# EAGLE design PanelPCB (EAGLE 9.6.2)
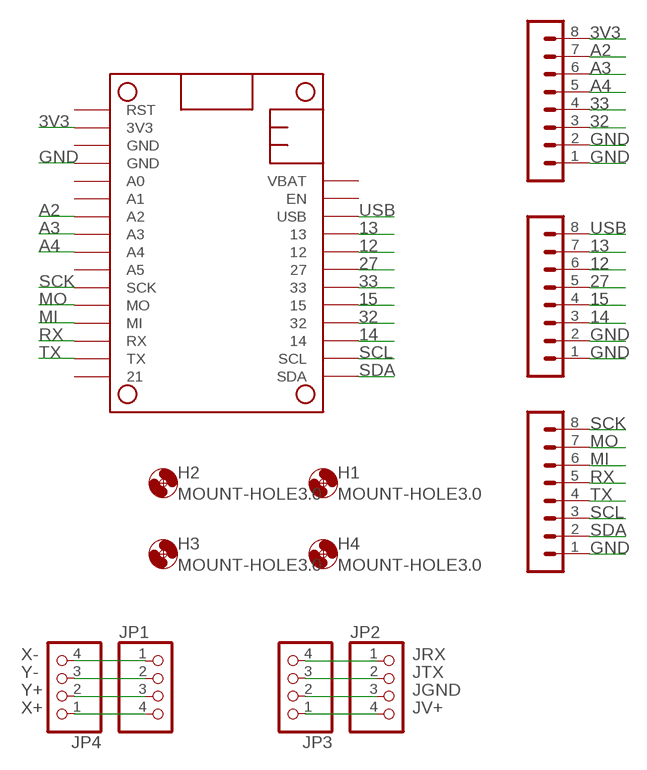
[diagram p0: schematic, sheet 1]

## Parts
H1  MOUNT-HOLE3.0  [3,0]
H2  MOUNT-HOLE3.0  [3,0]
H3  MOUNT-HOLE3.0  [3,0]
H4  MOUNT-HOLE3.0  [3,0]
JP1  PINHD-1X4  [1X04]
JP2  PINHD-1X4  [1X04]
JP3  PINHD-1X4  [1X04]
JP4  PINHD-1X4  [1X04]
M1  RARNDT-MISCELANEOUS_FEATHERBOARD_ESP32FETHERWING_DIM_ESP32  [RARNDT-MISCELANEOUS_FEATHERBOARD_ESP32]
SV1  MA08-1  [MA08-1]
SV2  MA08-1  [MA08-1]
SV3  MA08-1  [MA08-1]

## Nets
3V3: M1.2(3V3) SV1.8
12: M1.24 SV2.6
13: M1.25 SV2.7
14: M1.19 SV2.3
15: M1.21 SV2.4
27: M1.23 SV2.5
32: M1.20 SV1.3
33: M1.22 SV1.4
A2: M1.7(A2) SV1.7
A3: M1.8(A3) SV1.6
A4: M1.9(A4) SV1.5
GND: M1.4(GND) SV1.1 SV1.2 SV2.1 SV2.2 SV3.1
JGND: JP2.3 JP3.2
JRX: JP2.1 JP3.4
JTX: JP2.2 JP3.3
JV+: JP2.4 JP3.1
MI: M1.13(MI) SV3.6
MO: M1.12(MO) SV3.7
RX: M1.14(RX) SV3.5
SCK: M1.11(SCK) SV3.8
SCL: M1.18(SCL) SV3.3
SDA: M1.17(SDA) SV3.2
TX: M1.15(TX) SV3.4
USB: M1.26(USB) SV2.8
X+: JP1.4 JP4.1
X-: JP1.1 JP4.4
Y+: JP1.3 JP4.2
Y-: JP1.2 JP4.3
Unconnected: M1.1(RST) M1.3(GND) M1.5(A0) M1.6(A1) M1.10(A5) M1.16 M1.27(EN) M1.28(VBAT)

## Library data of the parts
H1-H4 = holes:MOUNT-HOLE: MOUNTING HOLE with drill center marker
JP1-JP4 = pinhead:PINHD-1X4: PIN HEADER
M1 = StewartPlatform:RARNDT-MISCELANEOUS_FEATHERBOARD_ESP32
SV1-SV3 = con-lstb:MA08-1: PIN HEADER; OC_FARNELL: unknown; OC_NEWARK: unknown

## Board
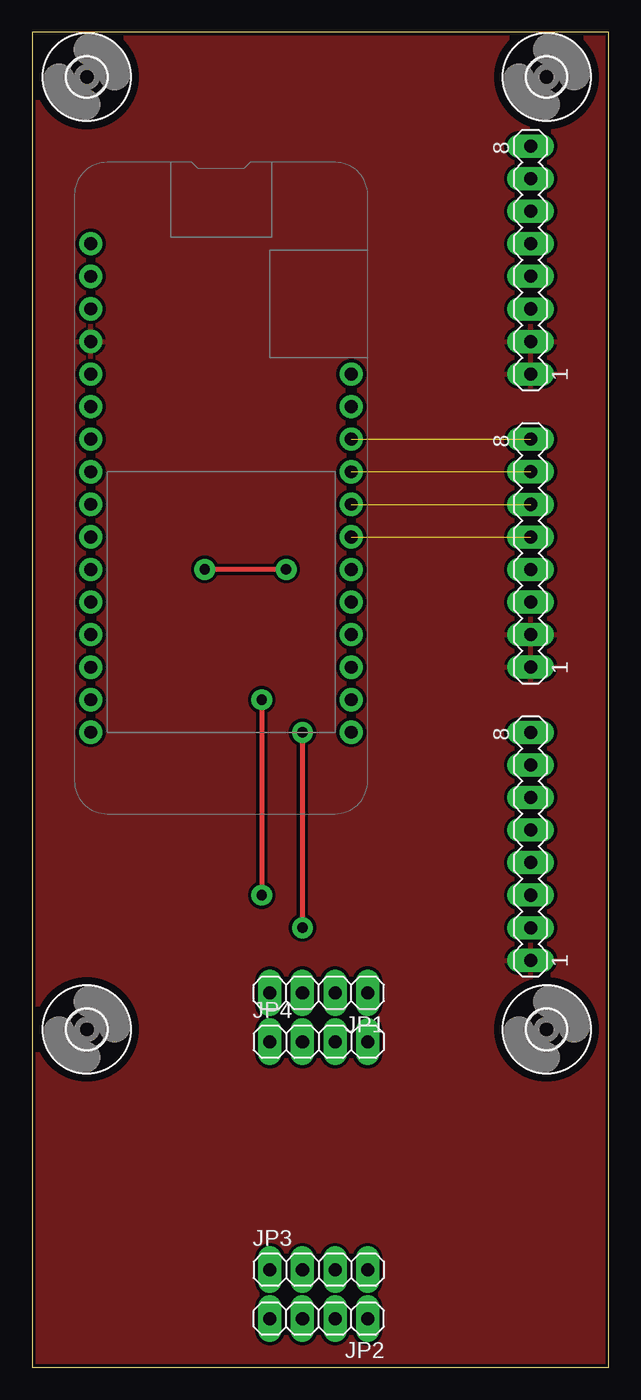
[diagram p1: board, top side]
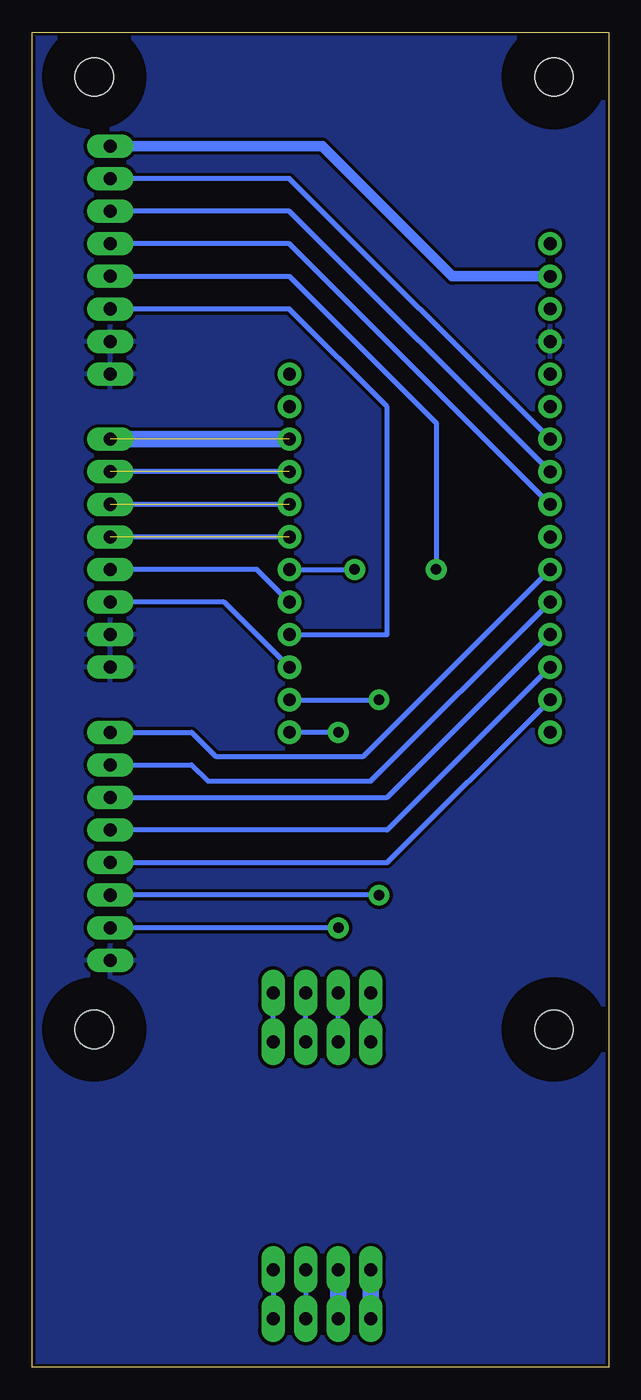
[diagram p2: board, bottom side, seen from below]

Size 44.96 x 104.14 mm. Coordinates in mm from the lower left corner, seen from the top.
Outline: 0,0 44.96,0 44.96,104.14 0,104.14 0,0
Copper layers (1*16): Top 0.035mm / dielectric 1.5mm / Bottom 0.035mm
Design rules "fablab_lpkf": minimum track width 16mil, minimum drill 32mil, track to track 10mil, track to pad 10mil, pad to pad 10mil, via to via 10mil, smd to smd 10mil, copper to edge 10mil, drill to drill 10mil, minimum pad ring 16mil, minimum via ring 16mil, stop-mask expansion 4mil, vias tented up to drill 0mil, thermal gap 10mil

### Footprints (pad centres in the part's own frame; a part is rotated, then mirrored left to right if it is on the bottom)
3,0 = hole 3: 0,0
1X04 = drill 1.016 long: 1 -3.81,0; 2 -1.27,0; 3 1.27,0; 4 3.81,0
RARNDT-MISCELANEOUS_FEATHERBOARD_ESP32 = drill 1: 1 -19.05,-10.16; 2 -16.51,-10.16; 3 -13.97,-10.16; 4 -11.43,-10.16; 5 -8.89,-10.16; 6 -6.35,-10.16; 7 -3.81,-10.16; 8 -1.27,-10.16; 9 1.27,-10.16; 10 3.81,-10.16; 11 6.35,-10.16; 12 8.89,-10.16; 13 11.43,-10.16; 14 13.97,-10.16; 15 16.51,-10.16; 16 19.05,-10.16; 17 19.05,10.16; 18 16.51,10.16; 19 13.97,10.16; 20 11.43,10.16; 21 8.89,10.16; 22 6.35,10.16; 23 3.81,10.16; 24 1.27,10.16; 25 -1.27,10.16; 26 -3.81,10.16; 27 -6.35,10.16; 28 -8.89,10.16
MA08-1 = drill 1.016 long: 1 -8.89,0; 2 -6.35,0; 3 -3.81,0; 4 -1.27,0; 5 1.27,0; 6 3.81,0; 7 6.35,0; 8 8.89,0

### Placement (x,y rotation side)
H1  4.27,26.37 0 top
H2  4.27,100.63 0 top
H3  40.11,26.37 0 top
H4  40.11,100.63 0 top
JP1  22.35,29.21 180 top
JP2  22.35,3.81 180 top
JP3  22.35,7.62 0 top
JP4  22.35,25.4 0 top
M1  14.73,68.58 270 top
SV1  38.86,86.36 90 top
SV2  38.86,63.5 90 top
SV3  38.86,40.64 90 top

### Tracks (layer width: path | path; a pad name or v marks a point on that pad's centre or on a via)
3V3
  Bottom 0.813: M1.2 12.19,85.09 22.35,95.25 SV1.8
12  (2 unrouted)
  Bottom 0.406: M1.24 SV2.6
13  (2 unrouted)
  Bottom 0.406: M1.25 SV2.7
14
  Bottom 0.406: M1.19 29.97,59.69 SV2.3
15
  Bottom 0.406: M1.21 27.43,62.23 SV2.4
27  (2 unrouted)
  Bottom 0.406: M1.23 SV2.5
32
  Bottom 0.406: M1.20 17.27,57.15 17.27,74.93 24.89,82.55 SV1.3
33  (via drill 0.81)
  Top 0.406: v19.81,62.23 v13.46,62.23
  Bottom 0.406: v13.46,62.23 13.46,73.66 24.89,85.09 SV1.4 | M1.22 v19.81,62.23
A2
  Bottom 0.406: M1.7 24.89,92.71 SV1.7
A3
  Bottom 0.406: M1.8 24.89,90.17 SV1.6
A4
  Bottom 0.406: M1.9 24.89,87.63 SV1.5
GND
  pour Top: -0.51,-1.27 -0.51,105.41 46.48,105.41 46.48,-1.27
  pour Bottom: -1.78,-2.54 -1.78,106.68 47.75,106.68 47.75,-2.54
JGND
  Bottom 1.27: JP3.2 JP2.3
JRX
  Bottom 0.406: JP3.4 JP2.1
JTX
  Bottom 0.406: JP3.3 JP2.2
JV+
  Bottom 1.27: JP3.1 JP2.4
MI
  Bottom 0.406: SV3.6 17.27,44.45 M1.13
MO
  Bottom 0.406: M1.12 18.54,45.72 31.24,45.72 32.51,46.99 SV3.7
RX
  Bottom 0.406: M1.14 17.27,41.91 SV3.5
SCK
  Bottom 0.406: SV3.8 32.51,49.53 30.63,47.65 19.15,47.65 M1.11
SCL  (via drill 0.81)
  Top 0.406: v17.91,52.07 v17.91,36.83
  Bottom 0.406: v17.91,36.83 SV3.3 | M1.18 v17.91,52.07
SDA  (via drill 0.81)
  Top 0.406: v21.08,49.53 v21.08,34.29
  Bottom 0.406: v21.08,34.29 SV3.2 | v21.08,49.53 M1.17
TX
  Bottom 0.406: M1.15 17.27,39.37 SV3.4
USB  (2 unrouted)
  Bottom 1.27: M1.26 SV2.8
X+
  Bottom 0.406: JP4.1 JP1.4
X-
  Bottom 0.406: JP4.4 JP1.1
Y+
  Bottom 0.406: JP4.2 JP1.3
Y-
  Bottom 0.406: JP4.3 JP1.2

### Text on the board
tDocu: 3V3 / A2 / A3 / A4 / 33 / 32 / GND / GND | USB / 13 / 12 / 27 / 15 / 14 / GND / GND | SCK / MO / MI / RX / TX / SCL / SDA / GND